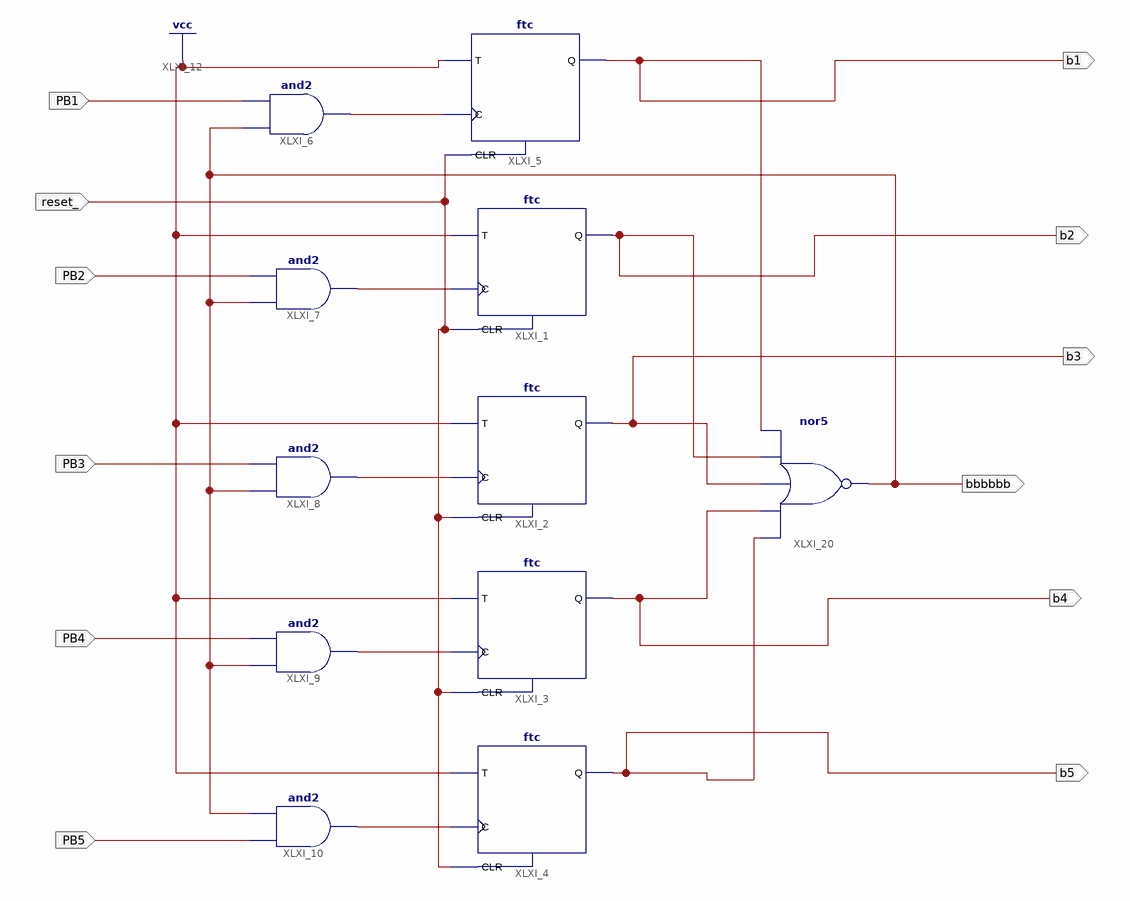
[diagram p0: schematic sheet 1]
// Xilinx ISE schematic PreState.sch (spartan6) as structural Verilog: 11 symbols, 12 ports
module PreState (
  input  reset_,
  input  PB1,
  input  PB3,
  input  PB4,
  input  PB5,
  input  PB2,
  output b2,
  output b5,
  output b1,
  output b4,
  output b3,
  output bbbbbb
);

  wire XLXN_11, XLXN_12, XLXN_13, XLXN_14, XLXN_15;

  ftc XLXI_1 (.C(XLXN_12), .CLR(reset_), .T(1'b1), .Q(b2));
  ftc XLXI_2 (.C(XLXN_13), .CLR(reset_), .T(1'b1), .Q(b3));
  ftc XLXI_3 (.C(XLXN_14), .CLR(reset_), .T(1'b1), .Q(b4));
  ftc XLXI_4 (.C(XLXN_15), .CLR(reset_), .T(1'b1), .Q(b5));
  ftc XLXI_5 (.C(XLXN_11), .CLR(reset_), .T(1'b1), .Q(b1));
  and XLXI_8 (XLXN_13, bbbbbb, PB3);
  and XLXI_10 (XLXN_15, PB5, bbbbbb);
  and XLXI_9 (XLXN_14, bbbbbb, PB4);
  and XLXI_7 (XLXN_12, bbbbbb, PB2);
  and XLXI_6 (XLXN_11, bbbbbb, PB1);
  nor XLXI_20 (bbbbbb, b5, b4, b3, b2, b1);
endmodule
